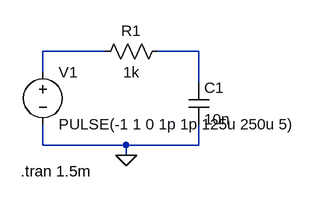
[diagram p0: schematic RC_circuit.asc]
RC_circuit.asc, the LTspice schematic file:
Version 4
SHEET 1 880 680
WIRE 160 80 64 80
WIRE 304 80 240 80
WIRE 64 112 64 80
WIRE 304 128 304 80
WIRE 64 224 64 192
WIRE 192 224 64 224
WIRE 304 224 304 192
WIRE 304 224 192 224
WIRE 192 240 192 224
FLAG 192 240 0
SYMBOL cap 288 128 R0
SYMATTR InstName C1
SYMATTR Value 10n
SYMBOL voltage 64 96 R0
WINDOW 123 0 0 Left 2
WINDOW 39 0 0 Left 2
SYMATTR InstName V1
SYMATTR Value PULSE(-1 1 0 1p 1p 125u 250u 5)
SYMBOL res 256 64 R90
WINDOW 0 0 56 VBottom 2
WINDOW 3 32 56 VTop 2
SYMATTR InstName R1
SYMATTR Value 1k
TEXT 30 264 Left 2 !.tran 1.5m

The netlist it stands for:
* RC_circuit.asc
C1 N002 0 10n
V1 N001 0 PULSE(-1 1 0 1p 1p 125u 250u 5)
R1 N002 N001 1k
.tran 1.5m
.backanno
.end